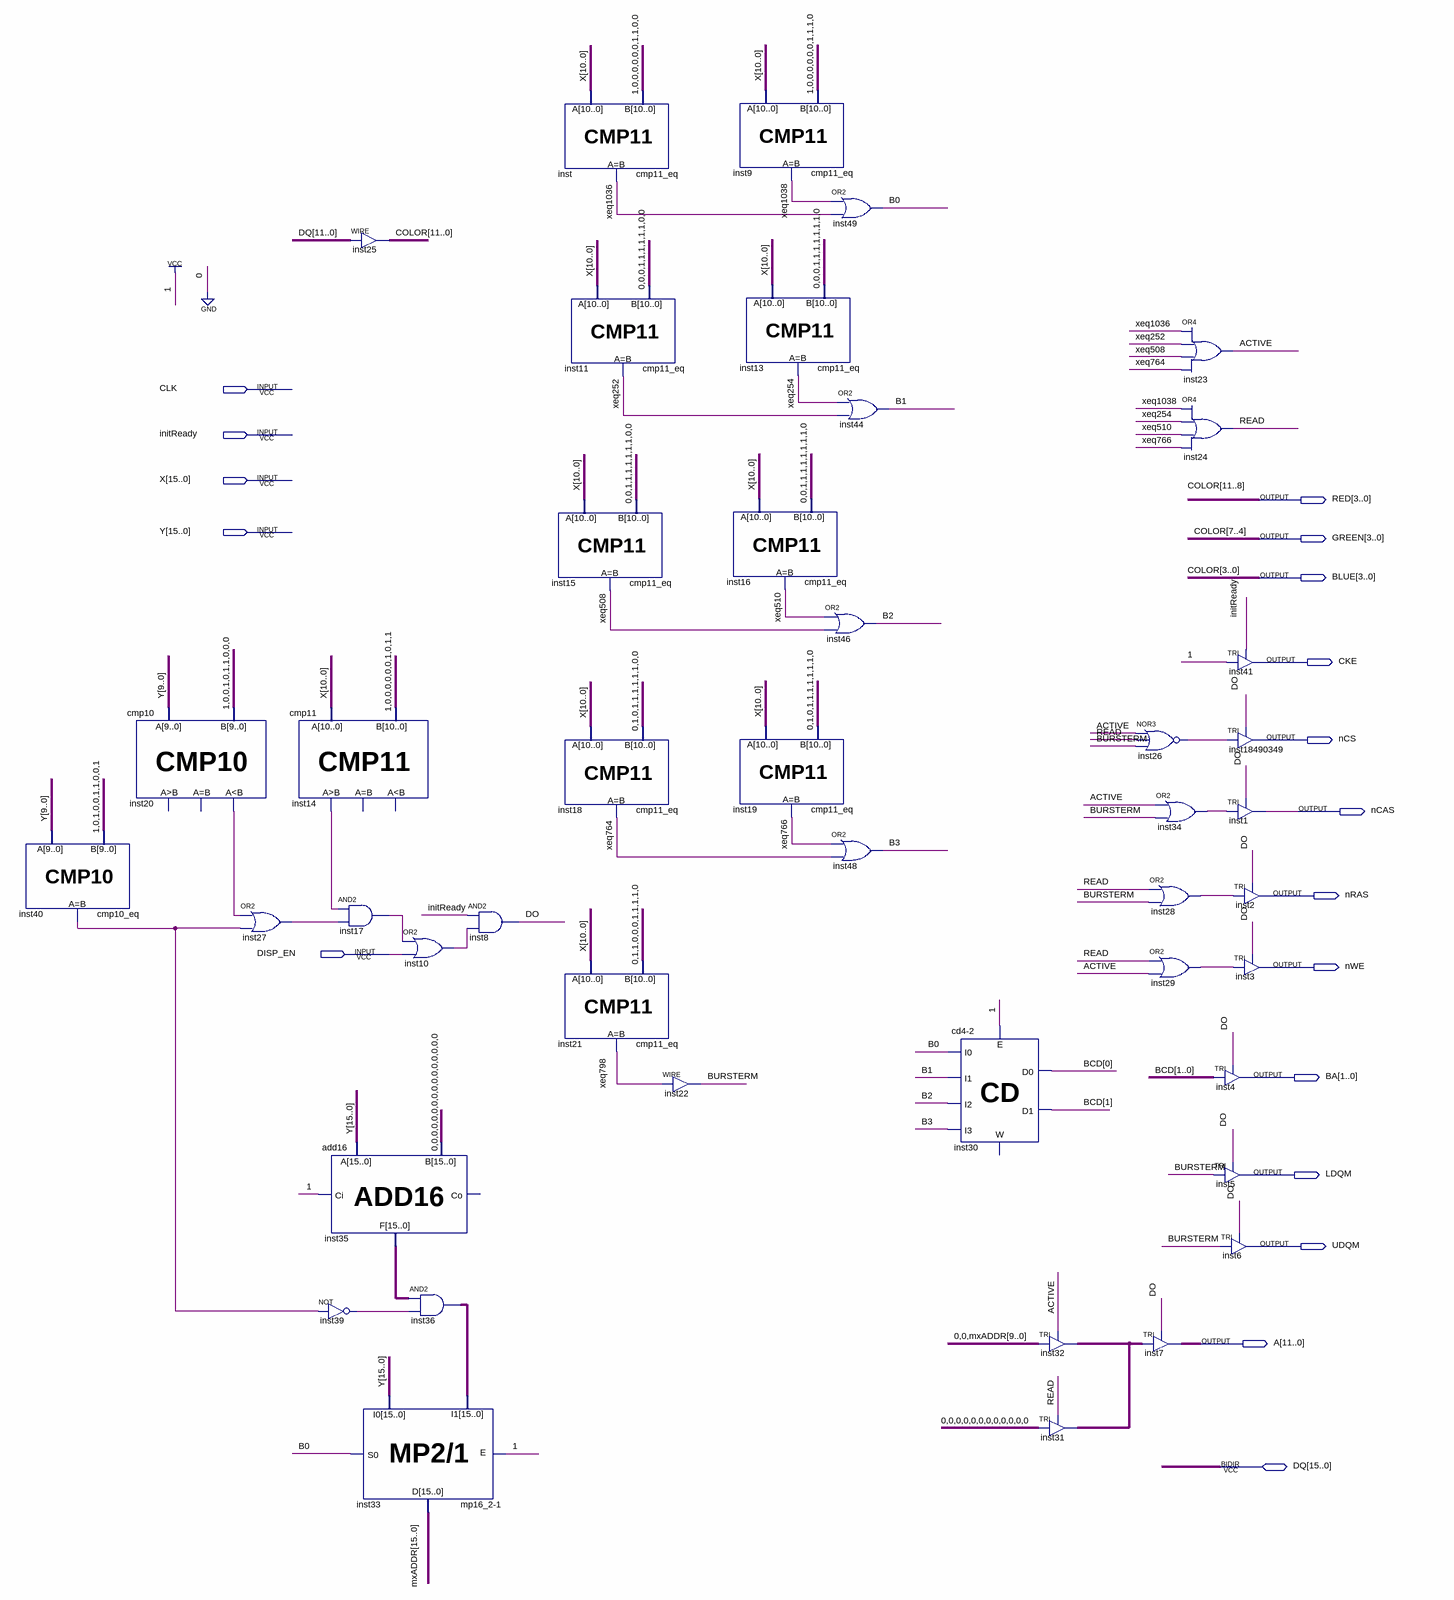
[diagram p0: schematic sheet]
// Quartus schematic GPU_read.bdf as structural Verilog: 44 symbols, 18 pins
module GPU_read (
  input  CLK,
  input  initReady,
  input  [15:0] X,
  input  [15:0] Y,
  input  DISP_EN,
  inout  [15:0] DQ,
  output [3:0] RED,
  output [3:0] GREEN,
  output [3:0] BLUE,
  output CKE,
  output nCS,
  output nCAS,
  output nRAS,
  output nWE,
  output [1:0] BA,
  output LDQM,
  output UDQM,
  output [11:0] A
);

  wire ACTIVE, B0, B1, B2, B3, BURSTERM, DO, inst10_out, inst14_gt, inst17_out, inst20_ls, inst26_out,
       inst27_out, inst28_out, inst29_out, inst34_out, inst39_out, inst40_eq, READ, xeq252, xeq254, xeq508,
       xeq510, xeq764, xeq766, xeq798, xeq1036, xeq1038;
  wire [1:0] BCD;
  wire [11:0] inst32_out;
  wire [15:0] inst35_f, inst36_out, mxADDR;

  cmp10_eq inst40 (.A(Y[9:0]), .B(10'b1010011001), .eq(inst40_eq));
  cmp10 inst20 (.A(Y[9:0]), .B(10'b1001011000), .Ls(inst20_ls));  // open: Eq, Gt
  or inst27 (inst27_out, inst20_ls, inst40_eq);
  cmp11 inst14 (.A(X[10:0]), .B(11'b10000001011), .Gt(inst14_gt));  // open: Ls, Eq
  add16 inst35 (.A(Y), .B({16{1'b0}}), .Ci(1'b1), .F(inst35_f));  // open: Co
  not inst39 (inst39_out, inst40_eq);
  assign {RED, GREEN, BLUE} = DQ[11:0];  // WIRE inst25
  and inst17 (inst17_out, inst14_gt, inst27_out);
  \mp16_2-1  inst33 (.E(1'b1), .I0(Y), .I1(inst36_out), .S0(B0), .D(mxADDR));
  or inst10 (inst10_out, inst17_out, DISP_EN);
  assign inst36_out = inst35_f & {16{inst39_out}};  // AND2 inst36, 16 bits wide
  and inst8 (DO, initReady, inst10_out);
  cmp11_eq inst (.A(X[10:0]), .B(11'b10000001100), .eq(xeq1036));
  cmp11_eq inst11 (.A(X[10:0]), .B(11'b00011111100), .eq(xeq252));
  cmp11_eq inst15 (.A(X[10:0]), .B(11'b00111111100), .eq(xeq508));
  cmp11_eq inst18 (.A(X[10:0]), .B(11'b01011111100), .eq(xeq764));
  cmp11_eq inst21 (.A(X[10:0]), .B(11'b01100011110), .eq(xeq798));
  assign BURSTERM = xeq798;  // WIRE inst22
  cmp11_eq inst9 (.A(X[10:0]), .B(11'b10000001110), .eq(xeq1038));
  cmp11_eq inst13 (.A(X[10:0]), .B(11'b00011111110), .eq(xeq254));
  cmp11_eq inst16 (.A(X[10:0]), .B(11'b00111111110), .eq(xeq510));
  cmp11_eq inst19 (.A(X[10:0]), .B(11'b01011111110), .eq(xeq766));
  or inst49 (B0, xeq1038, xeq1036);
  or inst44 (B1, xeq254, xeq252);
  or inst46 (B2, xeq510, xeq508);
  or inst48 (B3, xeq766, xeq764);
  \cd4-2  inst30 (.E(1'b1), .I0(B0), .I1(B1), .I2(B2), .I3(B3), .D1(BCD[1]), .D0(BCD[0]));  // open: W
  TRI inst32[11:0] (.IN({2'b00, mxADDR[9:0]}), .OE(ACTIVE), .OUT(inst32_out));
  TRI inst31[11:0] (.IN({12{1'b0}}), .OE(READ), .OUT(inst32_out));
  nor inst26 (inst26_out, ACTIVE, READ, BURSTERM);
  or inst28 (inst28_out, READ, BURSTERM);
  or inst29 (inst29_out, READ, ACTIVE);
  TRI inst7[11:0] (.IN(inst32_out), .OE(DO), .OUT(A));
  or inst23 (ACTIVE, xeq1036, xeq252, xeq508, xeq764);
  or inst24 (READ, xeq1038, xeq254, xeq510, xeq766);
  or inst34 (inst34_out, ACTIVE, BURSTERM);
  TRI inst41 (.IN(1'b1), .OE(initReady), .OUT(CKE));
  TRI inst18490349 (.IN(inst26_out), .OE(DO), .OUT(nCS));
  TRI inst1 (.IN(inst34_out), .OE(DO), .OUT(nCAS));
  TRI inst2 (.IN(inst28_out), .OE(DO), .OUT(nRAS));
  TRI inst3 (.IN(inst29_out), .OE(DO), .OUT(nWE));
  TRI inst4[1:0] (.IN(BCD), .OE(DO), .OUT(BA));
  TRI inst5 (.IN(BURSTERM), .OE(DO), .OUT(LDQM));
  TRI inst6 (.IN(BURSTERM), .OE(DO), .OUT(UDQM));

  // Other names for the same wires on the sheet: COLOR[11:0] = {RED, GREEN, BLUE}
endmodule
